# Altium schematic sheet CAp_Pont_H.SchDoc
size A3
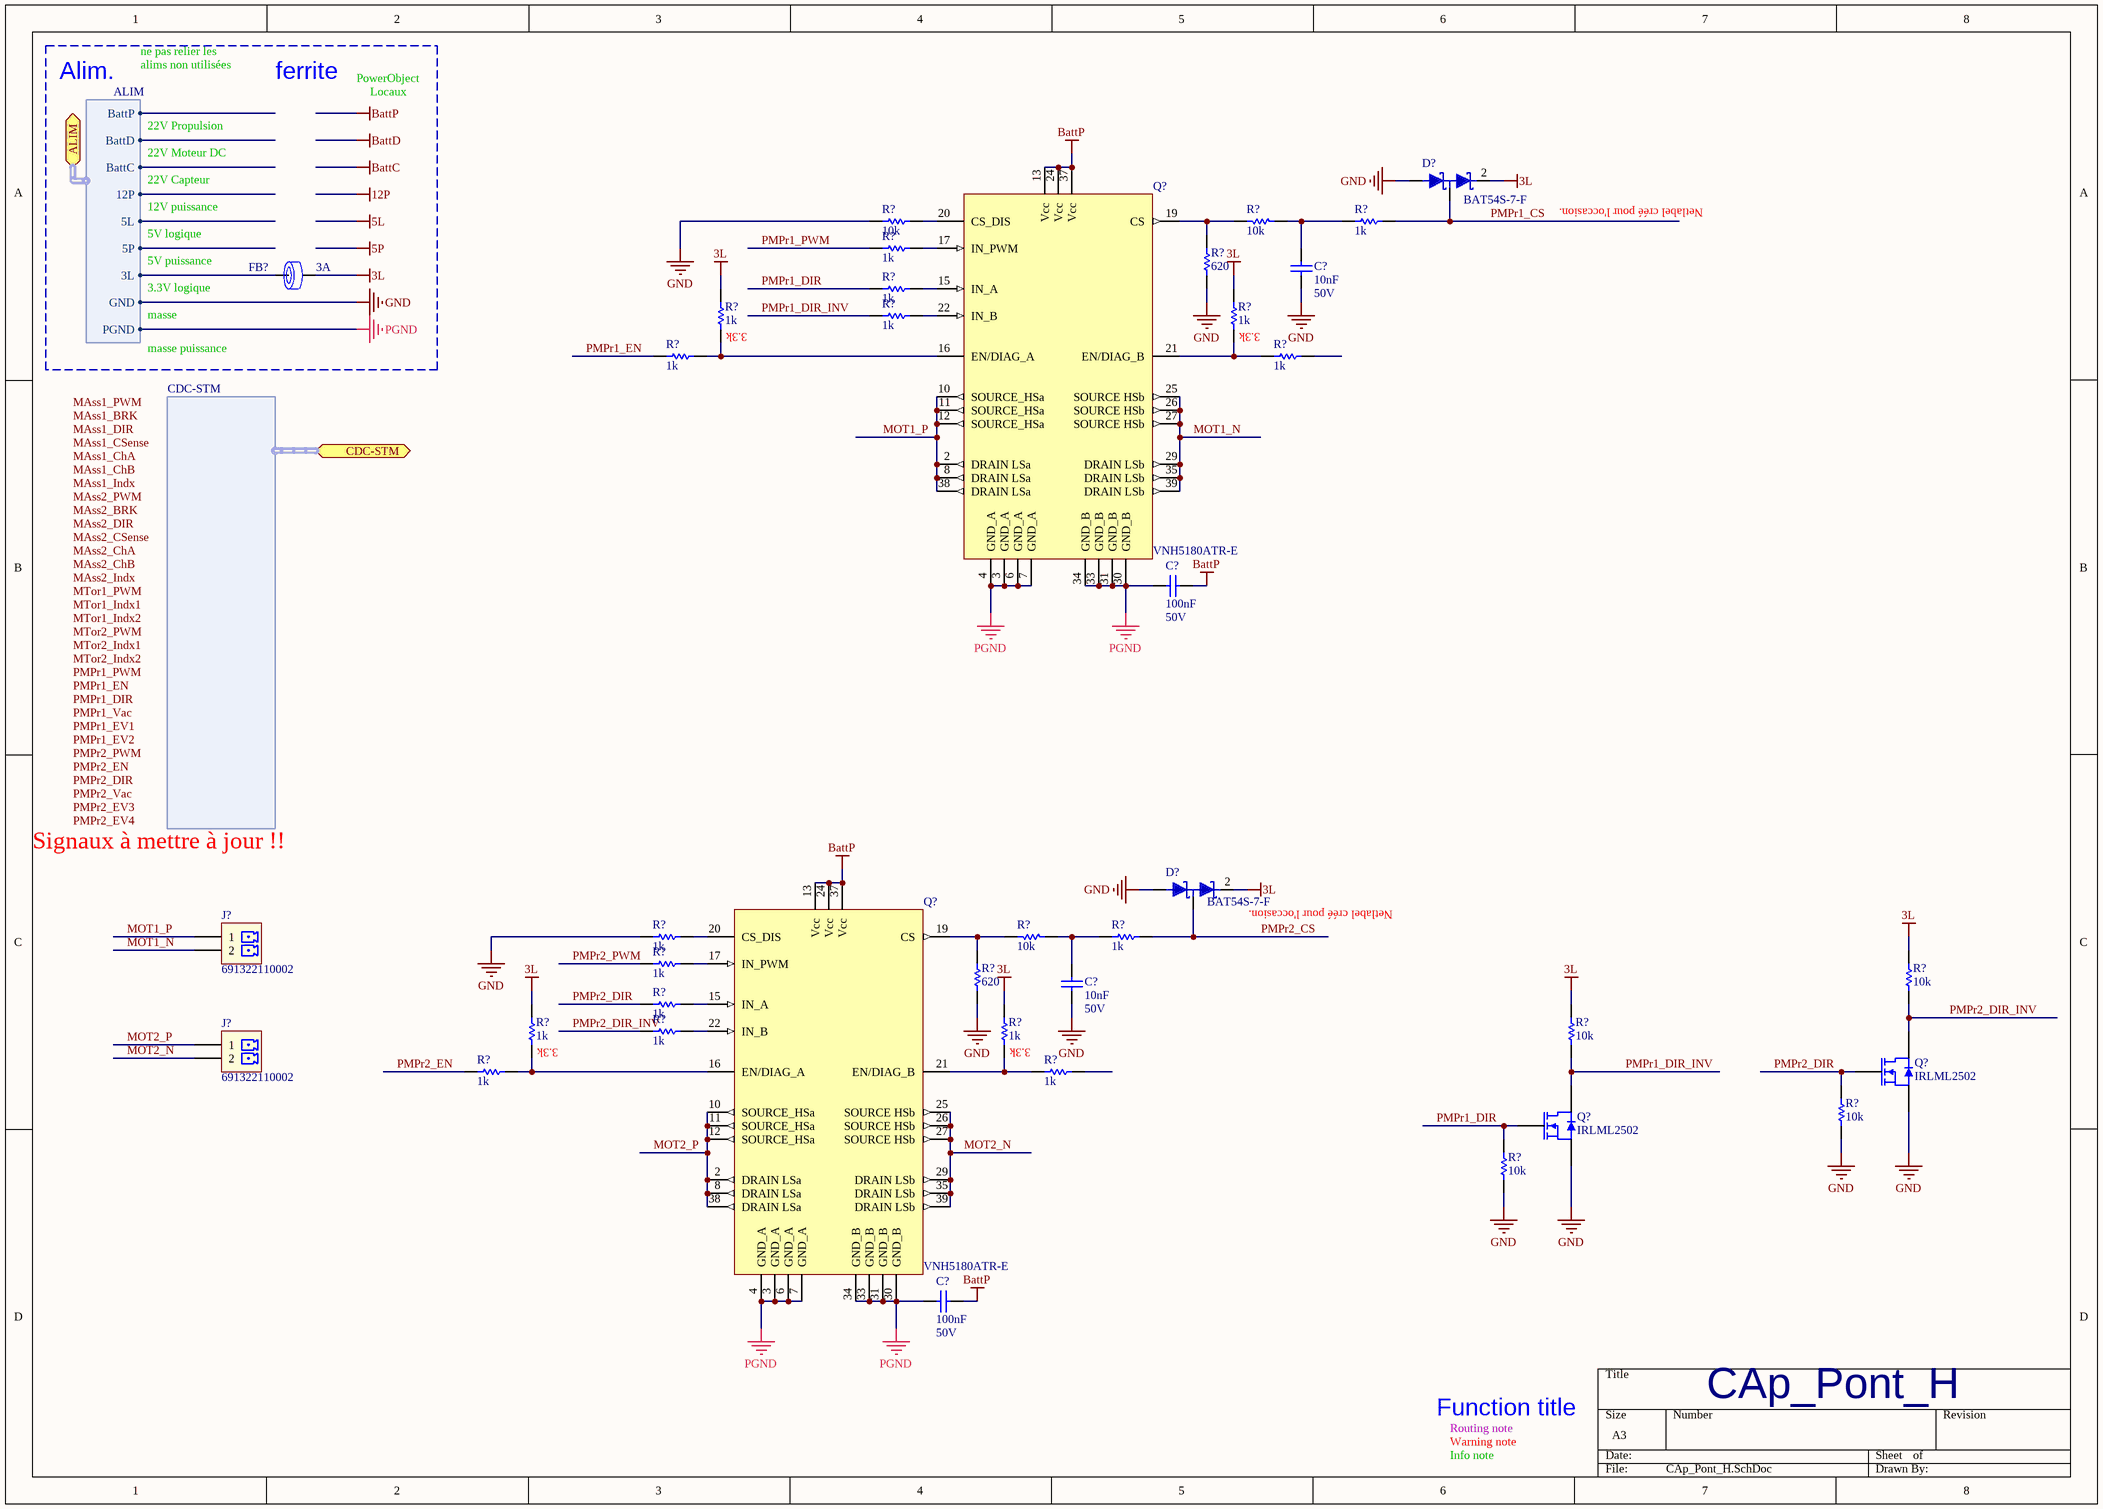
[diagram p0: CAp_Pont_H.SchDoc]

## Parts
(Parts that share a designator on the sheet are numbered #1, #2 ... from top to bottom, then left to right.)
C?#1  10nF  RatedVoltage: 50V  [WCAP-CSGP_0402, 1x0.5x0.5]
C?#2  100nF  RatedVoltage: 50V  [WCAP-CSGP_0603, 1.6x0.8x0.8]
C?#3  10nF  RatedVoltage: 50V  [WCAP-CSGP_0402, 1x0.5x0.5]
C?#4  100nF  RatedVoltage: 50V  [WCAP-CSGP_0603, 1.6x0.8x0.8]
D?#1  BAT54S-7-F  [SOT92P240X110-3N]
D?#2  BAT54S-7-F  [SOT92P240X110-3N]
FB?  RatedCurrent: 3A  [WE-CBF_0805_High Current]  (hidden comment: 742792023)
J?#1  691322110002  [691322110002]
J?#2  691322110002  [691322110002]
Q?#1  VNH5180ATR-E  [SSOP50P1030X247-36N]
Q?#2  VNH5180ATR-E  [SSOP50P1030X247-36N]
Q?#3  IRLML2502  [SOT-23]
Q?#4  IRLML2502  [SOT-23]
R?#1  value 10k  [RESC1005X04N]  (hidden comment: RC0402FR-0710KL)
R?#2  value 10k  [RESC1005X04N]  (hidden comment: RC0402FR-0710KL)
R?#3  value 1k  [RESC1005X04N]  (hidden comment: RC0402FR-071KL)
R?#4  value 1k  [RESC1005X04N]  (hidden comment: RC0402FR-071KL)
R?#5  value 1k  [RESC1005X04N]  (hidden comment: RC0402FR-071KL)
R?#6  value 620  [RESC1005X04N]  (hidden comment: RC0402FR-07620RL)
R?#7  value 1k  [RESC1005X04N]  (hidden comment: RC0402FR-071KL)
R?#8  value 1k  [RESC1005X04N]  (hidden comment: RC0402FR-071KL)
R?#9  value 1k  [RESC1005X04N]  (hidden comment: RC0402FR-071KL)
R?#10  value 1k  [RESC1005X04N]  (hidden comment: RC0402FR-071KL)
R?#11  value 1k  [RESC1005X04N]  (hidden comment: RC0402FR-071KL)
R?#12  value 1k  [RESC1005X04N]  (hidden comment: RC0402FR-071KL)
R?#13  value 10k  [RESC1005X04N]  (hidden comment: RC0402FR-0710KL)
R?#14  value 1k  [RESC1005X04N]  (hidden comment: RC0402FR-071KL)
R?#15  value 1k  [RESC1005X04N]  (hidden comment: RC0402FR-071KL)
R?#16  value 1k  [RESC1005X04N]  (hidden comment: RC0402FR-071KL)
R?#17  value 620  [RESC1005X04N]  (hidden comment: RC0402FR-07620RL)
R?#18  value 10k  [RESC1005X04N]  (hidden comment: RC0402FR-0710KL)
R?#19  value 1k  [RESC1005X04N]  (hidden comment: RC0402FR-071KL)
R?#20  value 1k  [RESC1005X04N]  (hidden comment: RC0402FR-071KL)
R?#21  value 1k  [RESC1005X04N]  (hidden comment: RC0402FR-071KL)
R?#22  value 10k  [RESC1005X04N]  (hidden comment: RC0402FR-0710KL)
R?#23  value 1k  [RESC1005X04N]  (hidden comment: RC0402FR-071KL)
R?#24  value 1k  [RESC1005X04N]  (hidden comment: RC0402FR-071KL)
R?#25  value 10k  [RESC1005X04N]  (hidden comment: RC0402FR-0710KL)
R?#26  value 10k  [RESC1005X04N]  (hidden comment: RC0402FR-0710KL)

## Ports
ALIM (harness ALIM), CDC-STM (harness CDC-STM)

## Harnesses
CDC-STM: 
ALIM: BattP, BattD, BattC, 12P, 5L, 5P, 3L, GND, PGND

## Nets
3L: D?#1.2 D?#2.2 FB?.2 R?#8.2 R?#9.2 R?#18.2 R?#20.2 R?#21.2 R?#22.2
BattP: C?#2.2 C?#4.2 Q?#1.13(Vcc) Q?#1.24(Vcc) Q?#1.37(Vcc) Q?#2.13(Vcc) Q?#2.24(Vcc) Q?#2.37(Vcc)
GND: C?#1.1 C?#3.1 D?#1.1 D?#2.1 Q?#3.2(S) Q?#4.2(S) R?#1.1 R?#6.1 R?#12.1 R?#17.1 R?#25.1 R?#26.1 ; port ALIM.GND
PGND: C?#2.1 C?#4.1 Q?#1.3(GND_A) Q?#1.4(GND_A) Q?#1.6(GND_A) Q?#1.7(GND_A) Q?#1.30(GND_B) Q?#1.31(GND_B) Q?#1.33(GND_B) Q?#1.34(GND_B) Q?#2.3(GND_A) Q?#2.4(GND_A) Q?#2.6(GND_A) Q?#2.7(GND_A) Q?#2.30(GND_B) Q?#2.31(GND_B) Q?#2.33(GND_B) Q?#2.34(GND_B) ; port ALIM.PGND
MOT1_N: J?#1.2 Q?#1.25(SOURCE_HSb) Q?#1.26(SOURCE_HSb) Q?#1.27(SOURCE_HSb) Q?#1.29(DRAIN_LSb) Q?#1.35(DRAIN_LSb) Q?#1.39(DRAIN_LSb)
MOT1_P: J?#1.1 Q?#1.2(DRAIN_LSa) Q?#1.8(DRAIN_LSa) Q?#1.10(SOURCE_HSa) Q?#1.11(SOURCE_HSa) Q?#1.12(SOURCE_HSa) Q?#1.38(DRAIN_LSa)
MOT2_N: J?#2.2 Q?#2.25(SOURCE_HSb) Q?#2.26(SOURCE_HSb) Q?#2.27(SOURCE_HSb) Q?#2.29(DRAIN_LSb) Q?#2.35(DRAIN_LSb) Q?#2.39(DRAIN_LSb)
MOT2_P: J?#2.1 Q?#2.2(DRAIN_LSa) Q?#2.8(DRAIN_LSa) Q?#2.10(SOURCE_HSa) Q?#2.11(SOURCE_HSa) Q?#2.12(SOURCE_HSa) Q?#2.38(DRAIN_LSa)
PMPr1_CS: D?#1.3 R?#3.2
PMPr1_DIR: Q?#4.1(G) R?#5.1 R?#26.2
PMPr1_DIR_INV: Q?#4.3(D) R?#7.1 R?#22.1
PMPr1_EN: R?#10.1
PMPr1_PWM: R?#4.1
PMPr2_CS: D?#2.3 R?#14.2
PMPr2_DIR: Q?#3.1(G) R?#16.1 R?#25.2
PMPr2_DIR_INV: Q?#3.3(D) R?#18.1 R?#19.1
PMPr2_EN: R?#23.1
PMPr2_PWM: R?#15.1
NetC?#1_2: C?#1.2 R?#2.2 R?#3.1
NetC?#3_2: C?#3.2 R?#13.2 R?#14.1
NetFB?_1: FB?.1 ; port ALIM.3L
NetQ?#1_15: Q?#1.15(IN_A) R?#5.2
NetQ?#1_16: Q?#1.16(EN/DIAG_A) R?#8.1 R?#10.2
NetQ?#1_17: Q?#1.17(IN_PWM) R?#4.2
NetQ?#1_19: Q?#1.19(CS) R?#2.1 R?#6.2
NetQ?#1_20: Q?#1.20(CS_DIS) R?#1.2
NetQ?#1_21: Q?#1.21(EN/DIAG_B) R?#9.1 R?#11.1
NetQ?#1_22: Q?#1.22(IN_B) R?#7.2
NetQ?#2_15: Q?#2.15(IN_A) R?#16.2
NetQ?#2_16: Q?#2.16(EN/DIAG_A) R?#20.1 R?#23.2
NetQ?#2_17: Q?#2.17(IN_PWM) R?#15.2
NetQ?#2_19: Q?#2.19(CS) R?#13.1 R?#17.2
NetQ?#2_20: Q?#2.20(CS_DIS) R?#12.2
NetQ?#2_21: Q?#2.21(EN/DIAG_B) R?#21.1 R?#24.1
NetQ?#2_22: Q?#2.22(IN_B) R?#19.2

Not connected (* = marked no-connect by the designer): Q?#1 1(nc) 5(nc) 9(nc) 14(nc) 18(nc) 23(nc) 28(nc) 32(nc) 36(nc); Q?#2 1(nc) 5(nc) 9(nc) 14(nc) 18(nc) 23(nc) 28(nc) 32(nc) 36(nc); R?#11 2; R?#24 2

## Notes on the sheet
- Alim.
- ne pas relier les
- alims non utilisées
- ferrite
- PowerObject
- Locaux
- 22V Propulsion
- 22V Moteur DC
- 22V Capteur
- 5V logique
- 12V puissance
- Netlabel créé pour l'occasion.
- 5V puissance
- 3.3V logique
- masse
- masse puissance
- (near R?#8) 3.3k
- (near R?#9) 3.3k
- Signaux à mettre à jour !!
- (near D?#2) Netlabel créé pour l'occasion.
- (near R?#20) 3.3k
- (near R?#21) 3.3k
- Function title
- Routing note
- Warning note
- Info note
- CAp_Pont_H
- Labels drawn without touching a wire or pin: MAss1_BRK, MAss1_ChA, MAss1_ChB, MAss1_CSense, MAss1_DIR, MAss1_Indx, MAss1_PWM, MAss2_BRK, MAss2_ChA, MAss2_ChB, MAss2_CSense, MAss2_DIR, MAss2_Indx, MAss2_PWM, MTor1_Indx1, MTor1_Indx2, MTor1_PWM, MTor2_Indx1, MTor2_Indx2, MTor2_PWM, PMPr1_DIR, PMPr1_EN, PMPr1_EV1, PMPr1_EV2, PMPr1_PWM, PMPr1_Vac, PMPr2_DIR, PMPr2_EN, PMPr2_EV3, PMPr2_EV4, PMPr2_PWM, PMPr2_Vac

## Library data of the parts
C?#1 C?#3 = WCAP-CSGP, 885012205067: CAP CER 10nF 50V X7R 0402; Manufacturer: Wurth Elektronik; PublishedDate: Aug 2016; ComponentLink1Description: Manufacturer; ComponentLink1URL: http://www.we-online.de; ComponentLink2Description: Datasheet; ComponentLink2URL: http://katalog.we-online.com/pbs/datasheet/885012205067.pdf; Manufacturer Part Number: 885012205067; Value: 10nF; Size: 0402; CeramicType: X7R
C?#2 C?#4 = WCAP-CSGP, 885012206095: CAP CER 100nF 50V X7R 0603; Manufacturer: Wurth Elektronik; PublishedDate: Aug 2016; ComponentLink1Description: Manufacturer; ComponentLink1URL: http://www.we-online.de; ComponentLink2Description: Datasheet; ComponentLink2URL: http://katalog.we-online.com/pbs/datasheet/885012206095.pdf; Manufacturer Part Number: 885012206095; Value: 100nF; Size: 0603; CeramicType: X7R
D?#1 D?#2 = BAT54S-7-F: DIODE ARRAY SCHOTTKY 30V SOT23-3; Manufacturer: Diodes Incorporated; Supplier 1: Farnell; Supplier Part Number 1: 9526510; Manufacturer Part Number: BAT54S-7-F; ComponentLink1URL: https://www.diodes.com/assets/Datasheets/ds11005.pdf; ComponentLink1Description: References
FB? = WE-CBF, 742792023: Ferrite Bead 120ohm 0805 max3.0A; Manufacturer: Wurth Elektronik; Value: 120Ω; Type: High Current; PublishedDate: Aug 2016; ComponentLink1Description: Manufacturer; ComponentLink1URL: http://www.we-online.de; ComponentLink2Description: Datasheet; ComponentLink2URL: http://katalog.we-online.de/pbs/datasheet/742792023.pdf; Manufacturer Part Number: 742792023; Size: 0805
J?#1 J?#2 = 691322110002: TERM BLOCK HDR 2POS 90DEG 3.5MM; Manufacturer: Wurth Electronics Inc.; Value: 2; Supplier 1: Farnell; Manufacturer Part Number: 691322110002; ComponentLink1URL: http://www.we-online.com; Supplier Part Number 1: 1841315; ComponentLink1Description: Manufacturer; ComponentLink2Description: Datasheet; ComponentLink2URL: http://katalog.we-online.de/em/datasheet/6913221100xx.pdf
Q?#1 Q?#2 = VNH5180ATR-E: IC MOTOR DRIVER PAR 36POWERSSO; Manufacturer: STMicroelectronics; Manufacturer Part Number: VNH5180ATR-E; ComponentLink1URL: http://www.st.com/content/ccc/resource/technical/document/datasheet/ce/72/6c/f3/65/47/45/b3/CD00264619.pdf/files/CD00264619.pdf/jcr:content/translations/en.CD00264619.pdf; ComponentLink1Description: Datasheet; Supplier 1: Digi-Key; Supplier Part Number 1: 497-13075-6-ND
Q?#3 Q?#4 = IRLML2502: MOSFET CANAL N SOT-23; Manufacturer 1: INTERNATIONAL RECTIFIER; Manufacturer Part Number: IRLML2502PBF; ComponentLink1Description: Datasheet; ComponentLink1URL: http://www.farnell.com/datasheets/1912230.pdf; Supplier 1: Farnell; Supplier Part Number 1: 9102981
R?#1 R?#2 R?#13 R?#18 R?#22 R?#25 R?#26 = RC0402FR-0710KL: RES SMD 10K OHM 1% 1/16W 0402; Manufacturer: Yageo; Power: 63mW; Vmax: 50V; Type: Thick Film; ComponentLink1Description: Manufacturer; ComponentLink1URL: http://www.yageo.com/NewPortal/_en/index.jsp; ComponentLink2Description: Datasheet; ComponentLink2URL: http://www.farnell.com/datasheets/2167052.pdf; Supplier 1: Farnell; Supplier Part Number 1: 9239359; Manufacturer Part Number: RC0402FR-0710KL; Precision: ±1%
R?#3-R?#5 R?#7-R?#12 R?#14-R?#16 R?#19-R?#21 R?#23 R?#24 = RC0402FR-071KL: RES SMD 1K OHM 1% 1/16W 0402; Manufacturer: Yageo; Power: 63mW; Vmax: 50V; Type: Thick Film; ComponentLink1Description: Manufacturer; ComponentLink1URL: http://www.yageo.com/NewPortal/_en/index.jsp; ComponentLink2Description: Datasheet; ComponentLink2URL: http://www.farnell.com/datasheets/2167052.pdf; Manufacturer Part Number: RC0402FR-071KL; Supplier 1: Farnell; Supplier Part Number 1: 9239235; Precision: ±1%
R?#6 R?#17 = RC0402FR-07620RL: RES SMD 620 OHM 1% 1/16W 0402; Manufacturer: Yageo; Power: 63mW; Vmax: 50V; Type: Thick Film; ComponentLink1Description: Manufacturer; ComponentLink1URL: http://www.yageo.com/NewPortal/_en/index.jsp; ComponentLink2Description: Datasheet; ComponentLink2URL: http://www.farnell.com/datasheets/2167052.pdf; Manufacturer Part Number: RC0402FR-07620RL; Precision: ±1%; Supplier 1: Farnell; Supplier Part Number 1: 1458815